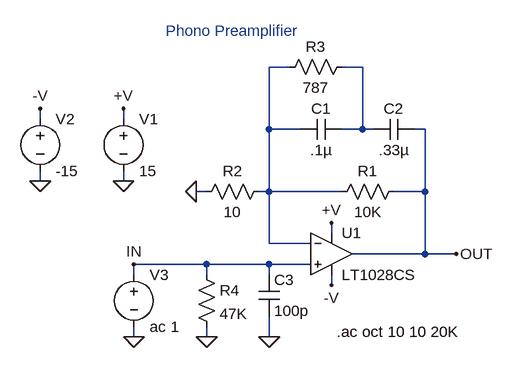
[diagram p0: schematic 1028CS.asc]
1028CS.asc, the LTspice schematic file:
Version 4
SHEET 1 896 680
WIRE 128 -48 96 -48
WIRE 240 -48 208 -48
WIRE -256 32 -256 16
WIRE -128 32 -128 16
WIRE 96 48 96 -48
WIRE 144 48 96 48
WIRE 240 48 240 -48
WIRE 240 48 208 48
WIRE 256 48 240 48
WIRE 336 48 320 48
WIRE -256 128 -256 112
WIRE -128 128 -128 112
WIRE 0 144 -16 144
WIRE 96 144 96 48
WIRE 96 144 80 144
WIRE 208 144 96 144
WIRE 336 144 336 48
WIRE 336 144 288 144
WIRE 192 208 192 192
WIRE 96 224 96 144
WIRE 160 224 96 224
WIRE 336 240 336 144
WIRE 336 240 224 240
WIRE 384 240 336 240
WIRE 0 256 -112 256
WIRE 96 256 0 256
WIRE 160 256 96 256
WIRE -112 272 -112 256
WIRE 0 272 0 256
WIRE 96 272 96 256
WIRE 192 288 192 272
WIRE -112 368 -112 352
WIRE 0 368 0 352
WIRE 96 368 96 336
FLAG -128 128 0
FLAG 192 192 +V
FLAG -128 16 +V
FLAG 192 288 -V
FLAG -256 128 0
FLAG -256 16 -V
FLAG -16 144 0
FLAG -112 368 0
FLAG 96 368 0
FLAG 0 368 0
FLAG -112 256 IN
FLAG 384 240 OUT
SYMBOL voltage -128 16 R0
SYMATTR InstName V1
SYMATTR Value 15
SYMBOL voltage -256 16 R0
SYMATTR InstName V2
SYMATTR Value -15
SYMBOL res 304 128 R90
WINDOW 0 0 56 VBottom 2
WINDOW 3 32 56 VTop 2
SYMATTR InstName R1
SYMATTR Value 10K
SYMBOL res 96 128 R90
WINDOW 0 0 56 VBottom 2
WINDOW 3 32 56 VTop 2
SYMATTR InstName R2
SYMATTR Value 10
SYMBOL voltage -112 256 R0
SYMATTR InstName V3
SYMATTR Value ac 1
SYMBOL cap 208 32 R90
WINDOW 0 0 32 VBottom 2
WINDOW 3 32 32 VTop 2
SYMATTR InstName C1
SYMATTR Value .1µ
SYMBOL cap 320 32 R90
WINDOW 0 0 32 VBottom 2
WINDOW 3 32 32 VTop 2
SYMATTR InstName C2
SYMATTR Value .33µ
SYMBOL res 224 -64 R90
WINDOW 0 0 56 VBottom 2
WINDOW 3 32 56 VTop 2
SYMATTR InstName R3
SYMATTR Value 787
SYMBOL cap 80 272 R0
SYMATTR InstName C3
SYMATTR Value 100p
SYMBOL res -16 256 R0
SYMATTR InstName R4
SYMATTR Value 47K
SYMBOL opamps\\LT1028CS 192 176 R0
SYMATTR InstName U1
TEXT 200 360 Left 2 !.ac oct 10 10 20K
TEXT 40 -88 Bottom 2 ;Phono Preamplifier

The netlist it stands for:
* 1028CS.asc
V1 +V 0 15
V2 -V 0 -15
R1 OUT N001 10K
R2 N001 0 10
V3 IN 0 ac 1
C1 N002 N001 .1µ
C2 OUT N002 .33µ
R3 N002 N001 787
C3 IN 0 100p
R4 IN 0 47K
XU1 IN N001 +V -V OUT LT1028CS  ; pins In+ In- V+ V- OUT
.ac oct 10 10 20K
* Phono Preamplifier
.backanno
.end